# EAGLE schematic joystick_controller (EAGLE 6.5.0)
AUTHOR: Paul Qureshi; REV: 1.0
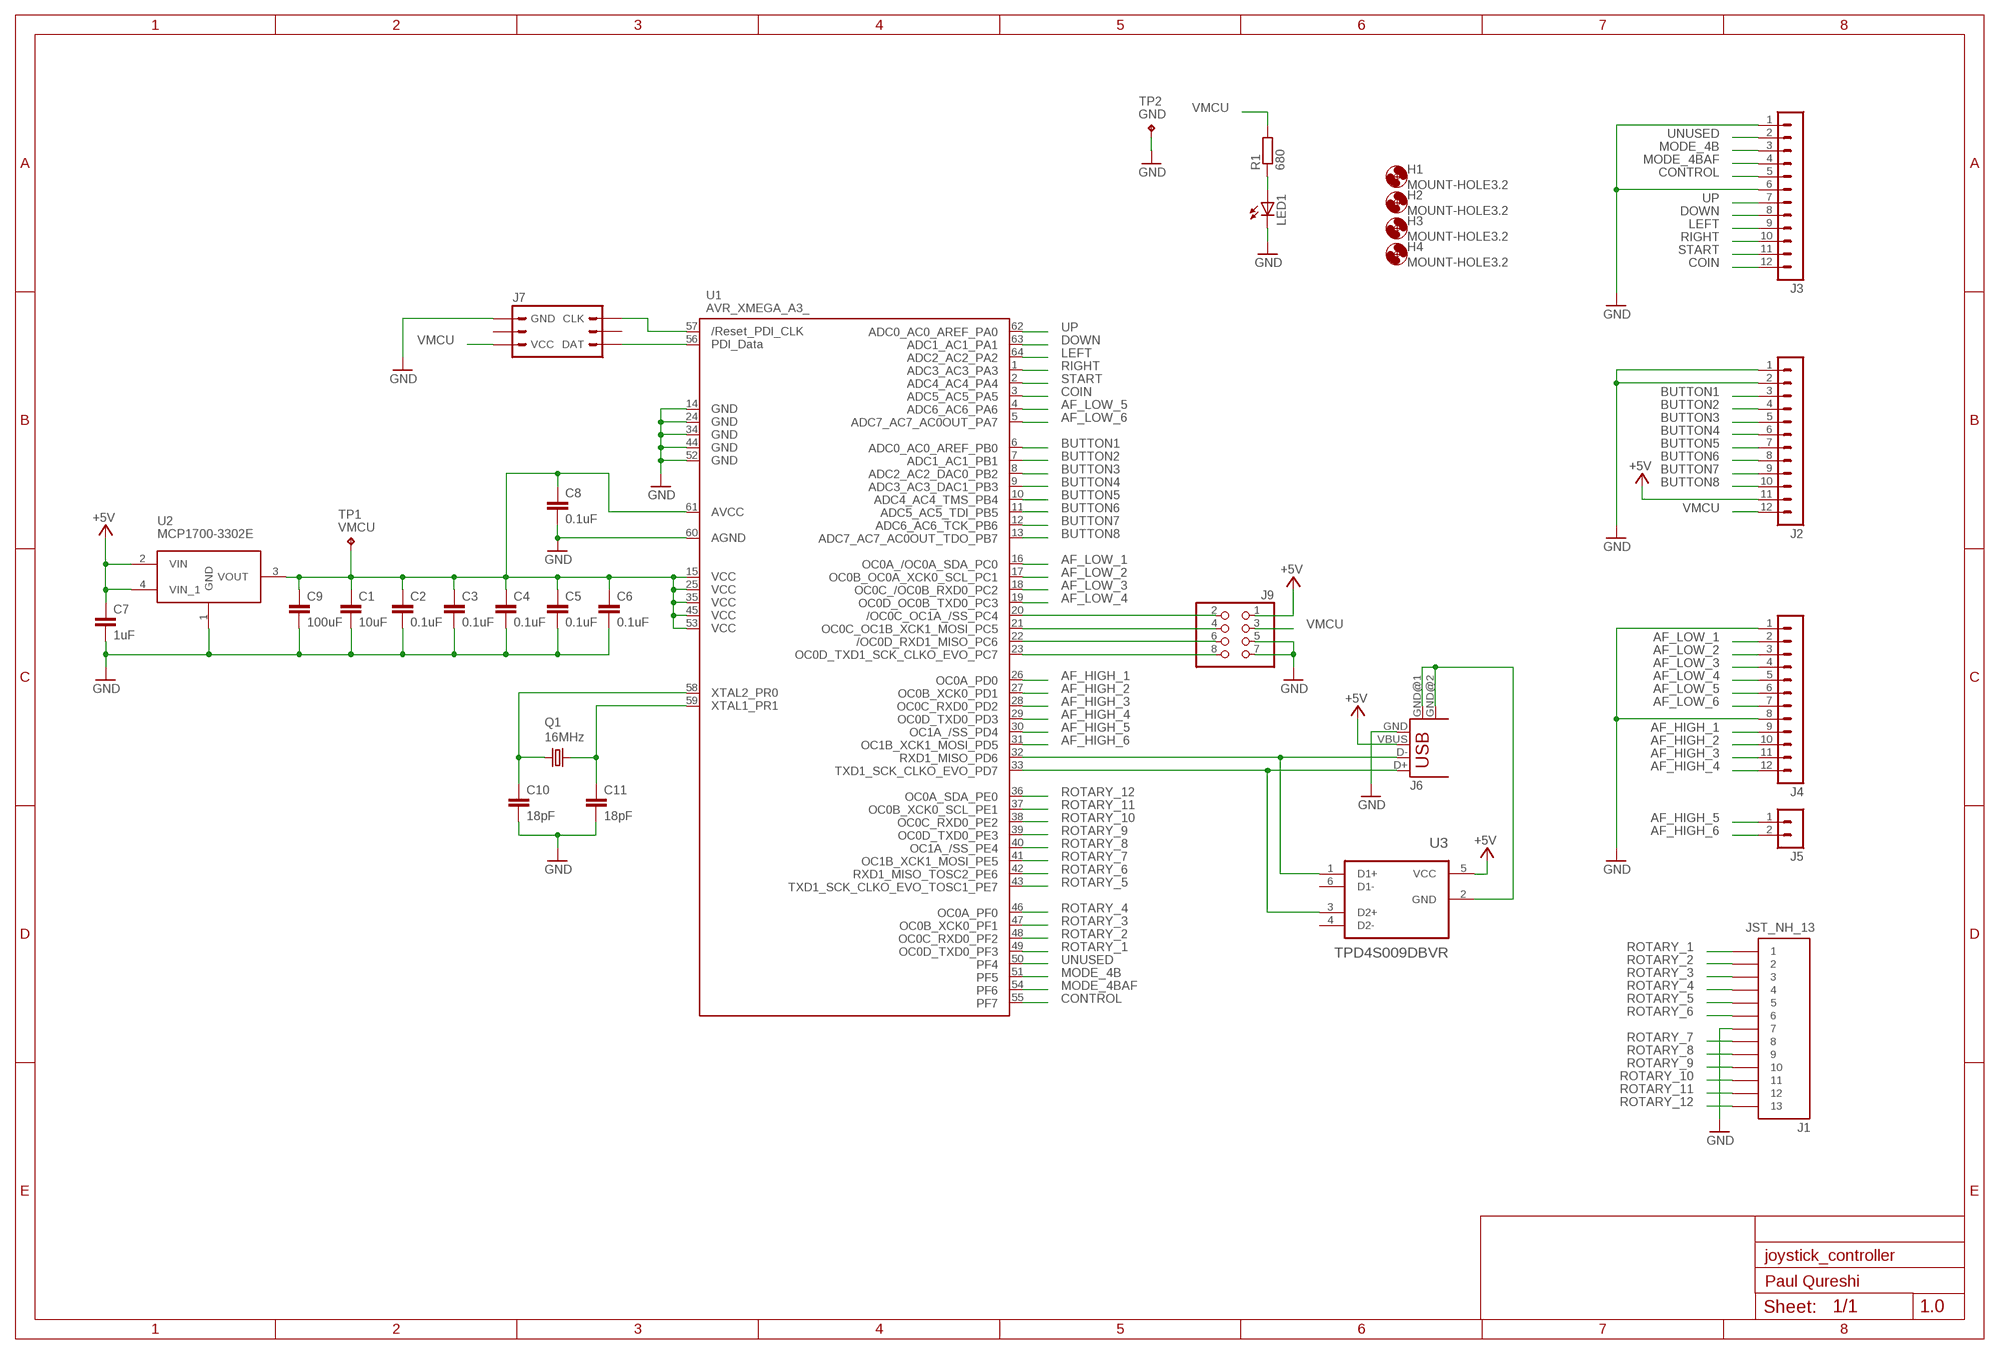
[diagram p0: schematic, sheet 1]

## Parts
C1  10uF  C-EUC0805  [C0805]
C2  0.1uF  C-EUC0805  [C0805]
C3  0.1uF  C-EUC0805  [C0805]
C4  0.1uF  C-EUC0805  [C0805]
C5  0.1uF  C-EUC0805  [C0805]
C6  0.1uF  C-EUC0805  [C0805]
C7  1uF  C-EUC0805  [C0805]
C8  0.1uF  C-EUC0805  [C0805]
C9  100uF  C-EUC1206  [C1206]
C10  18pF  C-EUC0805  [C0805]
C11  18pF  C-EUC0805  [C0805]
H1  MOUNT-HOLE3.2  [3,2]
H2  MOUNT-HOLE3.2  [3,2]
H3  MOUNT-HOLE3.2  [3,2]
H4  MOUNT-HOLE3.2  [3,2]
J1  JST_NH_13  [JST_NH_13_RA]
J2  CON-3.5TERM-12  [CON-3.5TERM-12]
J3  CON-3.5TERM-12  [CON-3.5TERM-12]
J4  CON-3.5TERM-12  [CON-3.5TERM-12]
J5  CON-3.5TERM-2  [CON-3.5TERM-2]
J6  USB-B-H  [USB-B-H]
J7  PDI_HEADER  [MA03-2]
J9  PINHD-2X4  [2X04]
LED1  LEDCHIP-LED0805  [CHIP-LED0805]
Q1  16MHz  CRYSTALHC49S  [HC49/S]
R1  680  R-EU_R0805  [R0805]
TP1  VMCU  TEST_POINTS1751  [HARWIN-S1751-46]
TP2  GND  TEST_POINTS1751  [HARWIN-S1751-46]
U1  AVR_XMEGA_A3_  [TQFP64]
U2  MCP1700-3302E  MCP17-MCP1700T-3302E/MB  [SOT150P400X160-4N]
U3  TPD4S009DBVR  [SOT95P280X145-6N]

## Nets
+5V: C7.1 J2.11 J6.VBUS J9.1 U2.2(VIN) U2.4(VIN_1) U3.5(VCC)
AF_HIGH_1: J4.9 U1.26(PD0)
AF_HIGH_2: J4.10 U1.27(PD1)
AF_HIGH_3: J4.11 U1.28(PD2)
AF_HIGH_4: J4.12 U1.29(PD3)
AF_HIGH_5: J5.1 U1.30(PD4)
AF_HIGH_6: J5.2 U1.31(PD5)
AF_LOW_1: J4.2 U1.16(PC0)
AF_LOW_2: J4.3 U1.17(PC1)
AF_LOW_3: J4.4 U1.18(PC2)
AF_LOW_4: J4.5 U1.19(PC3)
AF_LOW_5: J4.6 U1.4(PA6)
AF_LOW_6: J4.7 U1.5(PA7)
BUTTON1: J2.3 U1.6(PB0)
BUTTON2: J2.4 U1.7(PB1)
BUTTON3: J2.5 U1.8(PB2)
BUTTON4: J2.6 U1.9(PB3)
BUTTON5: J2.7 U1.10(PB4)
BUTTON6: J2.8 U1.11(PB5)
BUTTON7: J2.9 U1.12(PB6)
BUTTON8: J2.10 U1.13(PB7)
COIN: J3.12 U1.3(PA5)
CONTROL: J3.5 U1.55(PF7)
D_M: J6.D- U1.32(PD6) U3.1(D1+)
D_P: J6.D+ U1.33(PD7) U3.3(D2+)
DOWN: J3.8 U1.63(PA1)
GND: C1.2 C2.2 C3.2 C4.2 C5.2 C6.2 C7.2 C8.2 C9.2 C10.2 C11.2 J1.7 J2.1 J2.2 J3.1 J3.6 J4.1 J4.8 J6.GND J7.6(GND) J9.5 J9.7 LED1.C TP2.P$1(Q1) U1.14(GND1) U1.24(GND2) U1.34(GND3) U1.44(GND4) U1.52(GND5) U1.60(AGND) U2.1(GND)
LEFT: J3.9 U1.64(PA2)
MODE_4B: J3.3 U1.51(PF5)
MODE_4BAF: J3.4 U1.54(PF6)
N$1: LED1.A R1.1
N$3: J7.1(DAT) U1.56(PDI_DATA)
N$4: J7.5(CLK) U1.57(RESET)
N$5: J6.GND@1(GND) J6.GND@2(GND) U3.2(GND)
N$6: J9.8 U1.23(PC7)
N$7: J9.6 U1.22(PC6)
N$8: J9.4 U1.21(PC5)
N$9: J9.2 U1.20(PC4)
N$89: C11.1 Q1.2 U1.59(PR1)
N$90: C10.1 Q1.1 U1.58(PR0)
RIGHT: J3.10 U1.1(PA3)
ROTARY_1: J1.1 U1.49(PF3)
ROTARY_2: J1.2 U1.48(PF2)
ROTARY_3: J1.3 U1.47(PF1)
ROTARY_4: J1.4 U1.46(PF0)
ROTARY_5: J1.5 U1.43(PE7)
ROTARY_6: J1.6 U1.42(PE6)
ROTARY_7: J1.8 U1.41(PE5)
ROTARY_8: J1.9 U1.40(PE4)
ROTARY_9: J1.10 U1.39(PE3)
ROTARY_10: J1.11 U1.38(PE2)
ROTARY_11: J1.12 U1.37(PE1)
ROTARY_12: J1.13 U1.36(PE0)
START: J3.11 U1.2(PA4)
UNUSED: J3.2 U1.50(PF4)
UP: J3.7 U1.62(PA0)
VMCU: C1.1 C2.1 C3.1 C4.1 C5.1 C6.1 C8.1 C9.1 J2.12 J7.2(VCC) J9.3 R1.2 TP1.P$1(Q1) U1.15(VCC1) U1.25(VCC2) U1.35(VCC3) U1.45(VCC4) U1.53(VCC5) U1.61(AVCC) U2.3(VOUT)
Unconnected: J7.3(NC) J7.4(NC) U3.4(D2-) U3.6(D1-)

## Notes on the sheet
- J6

## Library data of the parts
C1-C11 = rcl:C-EU: CAPACITOR, European symbol
H1-H4 = holes:MOUNT-HOLE: MOUNTING HOLE with drill center marker
J1 = paul_qureshi:JST_NH_13: JST NH series 13 pin connector
J2-J4 = paul_qureshi:CON-3.5TERM-12: 3.5mm pitch terminal block, 12 way
J5 = paul_qureshi:CON-3.5TERM-2: 3.5mm pitch terminal block, 2 way
J6 = con-usb-2:USB: USB Connectors
J7 = paul_qureshi:PDI_HEADER: Atmel PDI programming header
J9 = pinhead:PINHD-2X4: PIN HEADER
LED1 = led:LED: LED OSRAM: - CHIPLED LG R971, LG N971, LY N971, LG Q971, LY Q971, LO R971, LY R971 LH N974, LH R974 LS Q976, LO Q976, LY Q976 LO Q996 - Hyper CHIPLED LW Q18S LB Q993, LB Q99A, LB R99A - SideLED LS A670, LO A670, LY A670, LG A670, LP A670 LB A673, LV A673, LT A673, LW A673 LH A674 LY A675 LS A676, LA A676, LO A676, LY A676, LW A676 LS A679, LY A679, LG A679 - Hyper Micro SIDELED® LS Y876, LA Y876, LO Y876, LY Y876 LT Y87S - SmartLED LW L88C, LW L88S LB L89C, LB L89S, LG L890 LS L89K, LO L89K, LY L89K LS L896, LA L896, LO L896, LY L896 - TOPLED LS T670, LO T670, LY T670, LG T670, LP T670 LSG T670, LSP T670, LSY T670, LOP T670, LYG T670 LG T671, LOG T671, LSG T671 LB T673, LV T673, LT T673, LW T673 LH T674 LS T676, LA T676, LO T676, LY T676, LB T676, LH T676, LSB T676, LW T676 LB T67C, LV T67C, LT T67C, LS T67K, LO T67K, LY T67K, LW E67C LS E67B, LA E67B, LO E67B, LY E67B, LB E67C, LV E67C, LT E67C LW T67C LS T679, LY T679, LG T679 LS T770, LO T770, LY T770, LG T770, LP T770 LB T773, LV T773, LT T773, LW T773 LH T774 LS E675, LA E675, LY E675, LS T675 LS T776, LA T776, LO T776, LY T776, LB T776 LHGB T686 LT T68C, LB T68C - Hyper Mini TOPLED® LB M676 - Mini TOPLED Santana® LG M470 LS M47K, LO M47K, LY M47K Source: http://www.osram.convergy.de LUXEON: - LUMILED® LXK2-PW12-R00, LXK2-PW12-S00, LXK2-PW14-U00, LXK2-PW14-V00 LXK2-PM12-R00, LXK2-PM12-S00, LXK2-PM14-U00 LXK2-PE12-Q00, LXK2-PE12-R00, LXK2-PE12-S00, LXK2-PE14-T00, LXK2-PE14-U00 LXK2-PB12-K00, LXK2-PB12-L00, LXK2-PB12-M00, LXK2-PB14-N00, LXK2-PB14-P00, LXK2-PB14-Q00 LXK2-PR12-L00, LXK2-PR12-M00, LXK2-PR14-Q00, LXK2-PR14-R00 LXK2-PD12-Q00, LXK2-PD12-R00, LXK2-PD12-S00 LXK2-PH12-R00, LXK2-PH12-S00 LXK2-PL12-P00, LXK2-PL12-Q00, LXK2-PL12-R00 Source: www.luxeon.com KINGBRIGHT: KA-3528ASYC Source: www.kingbright.com
Q1 = crystal:CRYSTAL: CRYSTAL; OC_FARNELL: 1667008; OC_NEWARK: unknown
R1 = resistor:R-EU_: RESISTOR, European symbol
TP1 TP2 = paul_qureshi:TEST_POINT: Test point
U1 = xmega:AVR_XMEGA_A3_: Device for Atmel AVR XMEGA A3 Series
U2 = paul_qureshi:MCP17: Low Quiescent Current LDO Regulator; MPN: MCP1700T-3302E/MB; OC_FARNELL: 1439380; OC_NEWARK: 88H9816; PACKAGE: SOT89-3; SUPPLIER: Microchip
U3 = paul_qureshi:TPD4S009DBVR: 4-CHANNEL ESD SOLUTION FOR HIGH-SPEED DIFFERENTIAL INTERFACE; MPN: TPD4S009DBVR; OC_FARNELL: 1855143; OC_NEWARK: 33R2191; PACKAGE: SOT-23-6; SUPPLIER: TEXAS INSTRUMENTS